# Altium schematic sheet optInput1.SchDoc
size 420 x 297 mm; Scale: 1:1; DocumentType: Схема электрическая принципиальная; FirstReferrence: АБВГ.123456.001
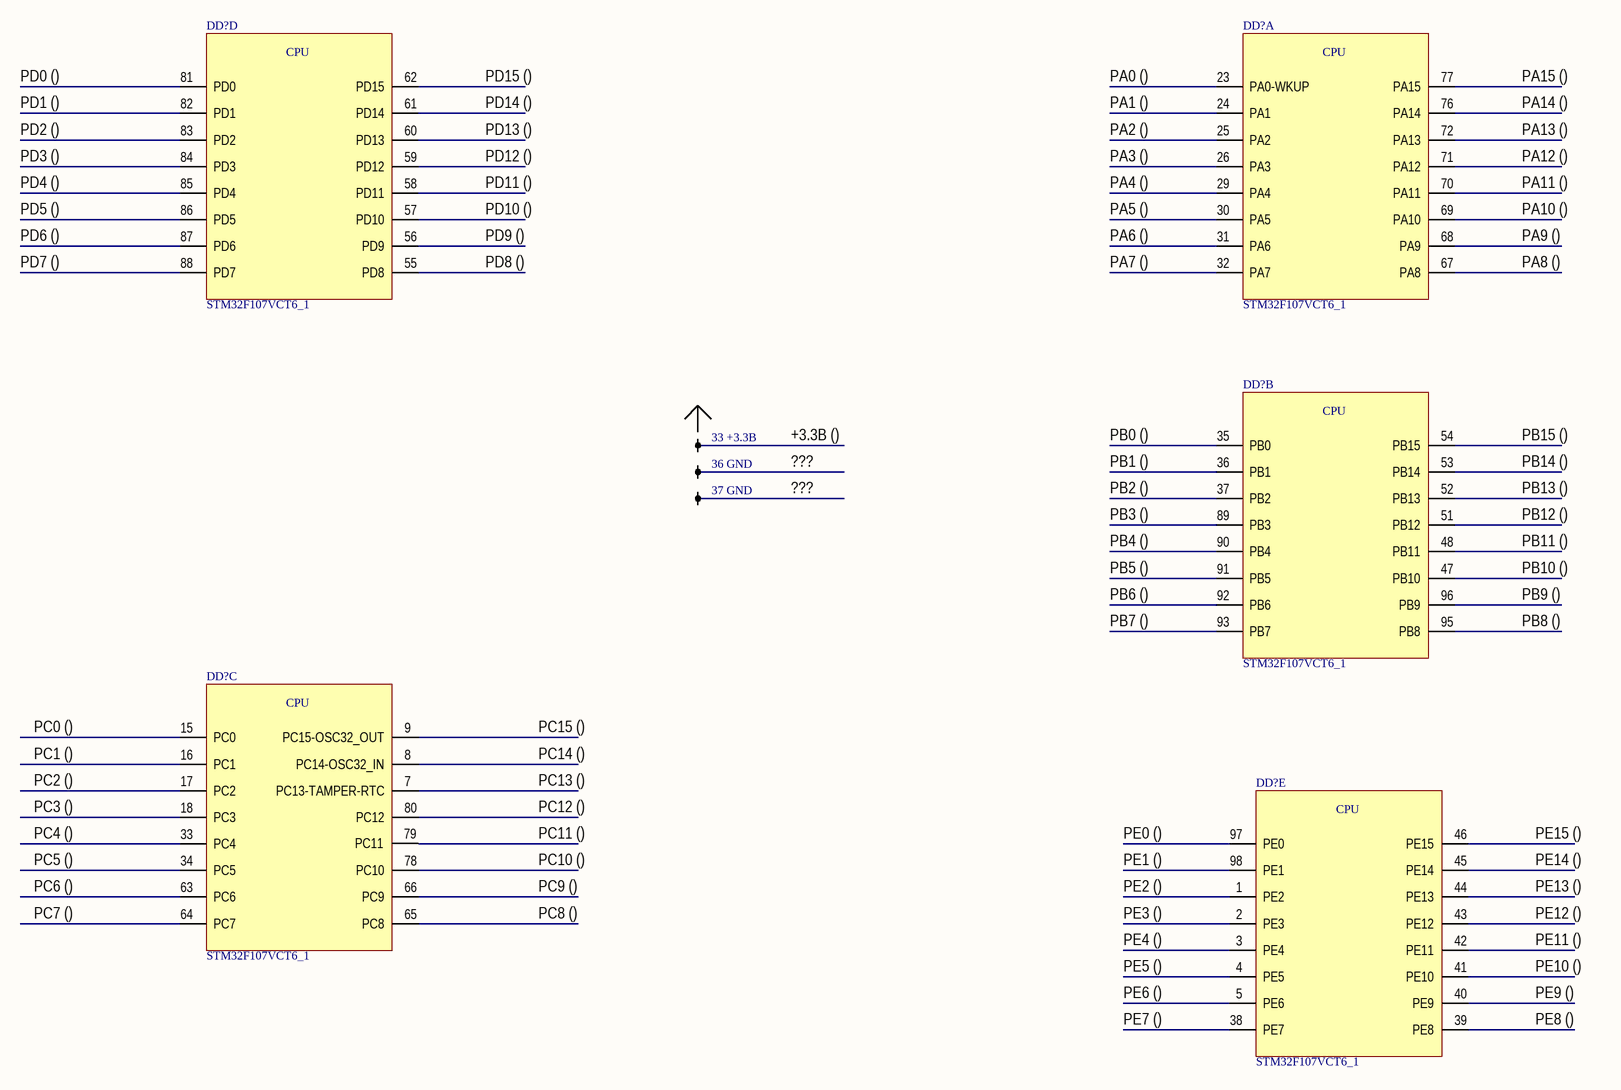
[diagram p0: optInput1.SchDoc]

## Parts
(Parts that share a designator on the sheet are numbered #1, #2 ... from top to bottom, then left to right.)
DD?#1  STM32F107VCT6_1  [LQFP100_N]  (part D of 6)
DD?#2  STM32F107VCT6_1  [LQFP100_N]  (part A of 6)
DD?#3  STM32F107VCT6_1  [LQFP100_N]  (part B of 6)
DD?#4  STM32F107VCT6_1  [LQFP100_N]  (part C of 6)
DD?#5  STM32F107VCT6_1  [LQFP100_N]  (part E of 6)
X?#1  33 +3.3В  [PLD40]  (part 33 of 40)
X?#2  36 GND  [PLD40]  (part 36 of 40)
X?#3  37 GND  [PLD40]  (part 37 of 40)

## Nets

Not connected (* = marked no-connect by the designer): DD?#1 55(PD8) 56(PD9) 57(PD10) 58(PD11) 59(PD12) 60(PD13) 61(PD14) 62(PD15) 81(PD0) 82(PD1) 83(PD2) 84(PD3) 85(PD4) 86(PD5) 87(PD6) 88(PD7); DD?#2 23(PA0-WKUP) 24(PA1) 25(PA2) 26(PA3) 29(PA4) 30(PA5) 31(PA6) 32(PA7) 67(PA8) 68(PA9) 69(PA10) 70(PA11) 71(PA12) 72(PA13) 76(PA14) 77(PA15); DD?#3 35(PB0) 36(PB1) 37(PB2) 47(PB10) 48(PB11) 51(PB12) 52(PB13) 53(PB14) 54(PB15) 89(PB3) 90(PB4) 91(PB5) 92(PB6) 93(PB7) 95(PB8) 96(PB9); DD?#4 7(PC13-TAMPER-RTC) 8(PC14-OSC32_IN) 9(PC15-OSC32_OUT) 15(PC0) 16(PC1) 17(PC2) 18(PC3) 33(PC4) 34(PC5) 63(PC6) 64(PC7) 65(PC8) 66(PC9) 78(PC10) 79(PC11) 80(PC12); DD?#5 1(PE2) 2(PE3) 3(PE4) 4(PE5) 5(PE6) 38(PE7) 39(PE8) 40(PE9) 41(PE10) 42(PE11) 43(PE12) 44(PE13) 45(PE14) 46(PE15) 97(PE0) 98(PE1); X?#1 33(1); X?#2 36(1); X?#3 37(1)

## Notes on the sheet
- PD0 ()
- PD1 ()
- PD14 ()
- PD15 ()
- PA0 ()
- PA1 ()
- PA14 ()
- PA15 ()
- PD2 ()
- PD3 ()
- PD4 ()
- PD11 ()
- PD12 ()
- PD13 ()
- PA2 ()
- PA3 ()
- PA4 ()
- PA11 ()
- PA12 ()
- PA13 ()
- PD5 ()
- PD6 ()
- PD9 ()
- PD10 ()
- PA5 ()
- PA6 ()
- PA9 ()
- PA10 ()
- PD7 ()
- PD8 ()
- PA7 ()
- PA8 ()
- +3.3В ()
- PB0 ()
- PB15 ()
- ???
- PB1 ()
- PB2 ()
- PB3 ()
- PB12 ()
- PB13 ()
- PB14 ()
- PB5 ()
- PB4 ()
- PB10 ()
- PB11 ()
- PB6 ()
- PB7 ()
- PB8 ()
- PB9 ()
- PС0 ()
- PС1 ()
- PС2 ()
- PС13 ()
- PС14 ()
- PС15 ()
- PС3 ()
- PС4 ()
- PС11 ()
- PС12 ()
- PE0 ()
- PE15 ()
- PС5 ()
- PС6 ()
- PС7 ()
- PС8 ()
- PС9 ()
- PС10 ()
- PE1 ()
- PE2 ()
- PE3 ()
- PE12 ()
- PE13 ()
- PE14 ()
- PE5 ()
- PE6 ()
- PE4 ()
- PE9 ()
- PE10 ()
- PE11 ()
- PE7 ()
- PE8 ()
- Подп. и дата
- Инв. № дубл.
- Взам. инв. №
- Инв. № подл.
- Изм.
- Лист
- № докум.
- Подп.
- Дата
- 2.106-A3
- Копировал
- Формат А3
- (in symbol STM32F107VCT6_1, part A) CPU
- (in symbol STM32F107VCT6_1, part B) CPU
- (in symbol STM32F107VCT6_1, part C) CPU
- (in symbol STM32F107VCT6_1, part D) CPU
- (in symbol STM32F107VCT6_1, part E) CPU

## Library data of the parts
X?#1-X?#3 = PLD40